# EAGLE design X-mas-star_V2 (EAGLE 9.6.2)
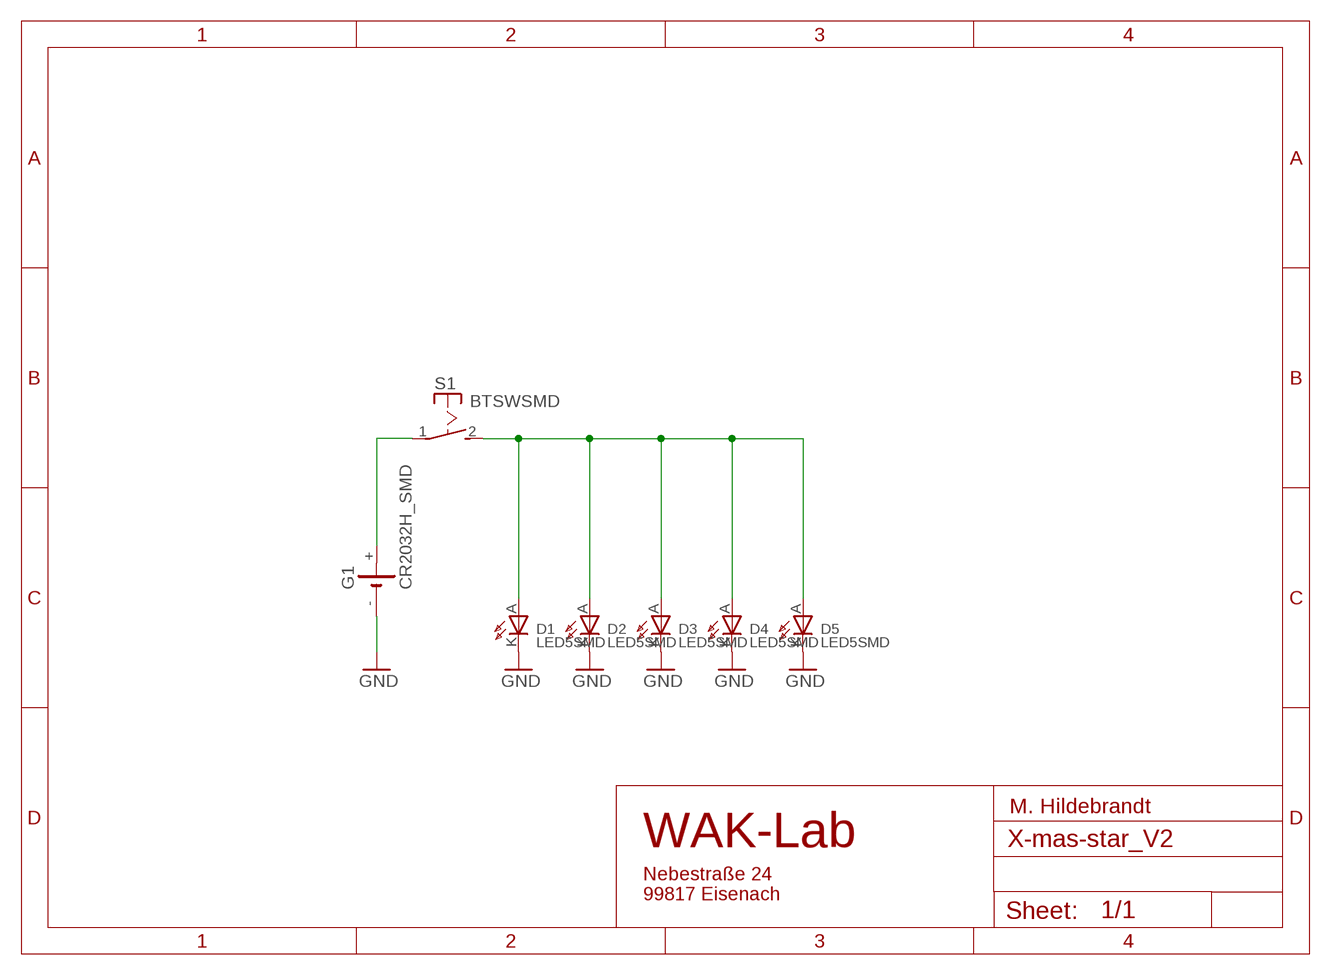
[diagram p0: schematic, sheet 1]

## Parts
D1  LED5SMD  [LED5MM_PADS]
D2  LED5SMD  [LED5MM_PADS]
D3  LED5SMD  [LED5MM_PADS]
D4  LED5SMD  [LED5MM_PADS]
D5  LED5SMD  [LED5MM_PADS]
G1  CR2032H_SMD  [CR2032H_SMD]
S1  BTSWSMD  [BTSW_SMD]

## Nets
GND: D1.K D2.K D3.K D4.K D5.K G1.-
N$12: D1.A D2.A D3.A D4.A D5.A S1.2(S)
N$29: G1.+ S1.1(P)

## Notes on the sheet
- M. Hildebrandt
- WAK-Lab
- Nebestraße 24
  99817 Eisenach

## Library data of the parts
D1-D5 = DIY-Parts:LED5
G1 = battery:CR2032H_SMD
S1 = DIY-Parts:BTSW

## Board
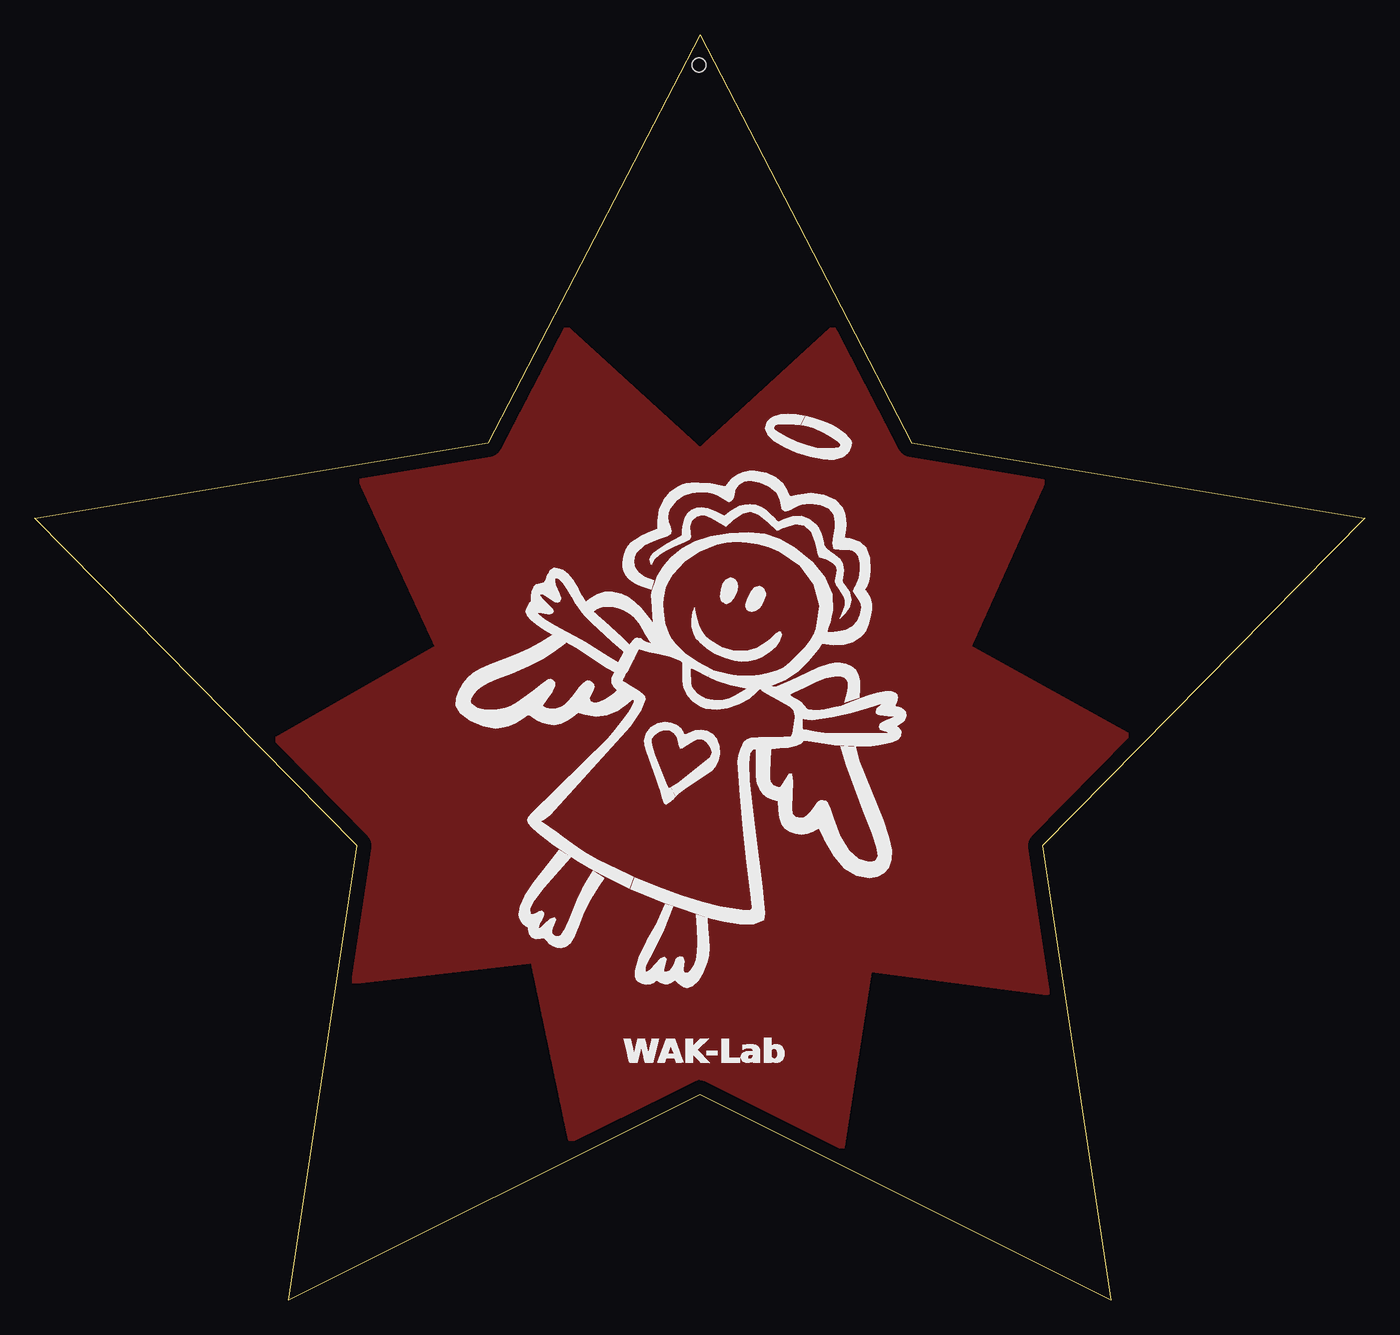
[diagram p1: board, top side]
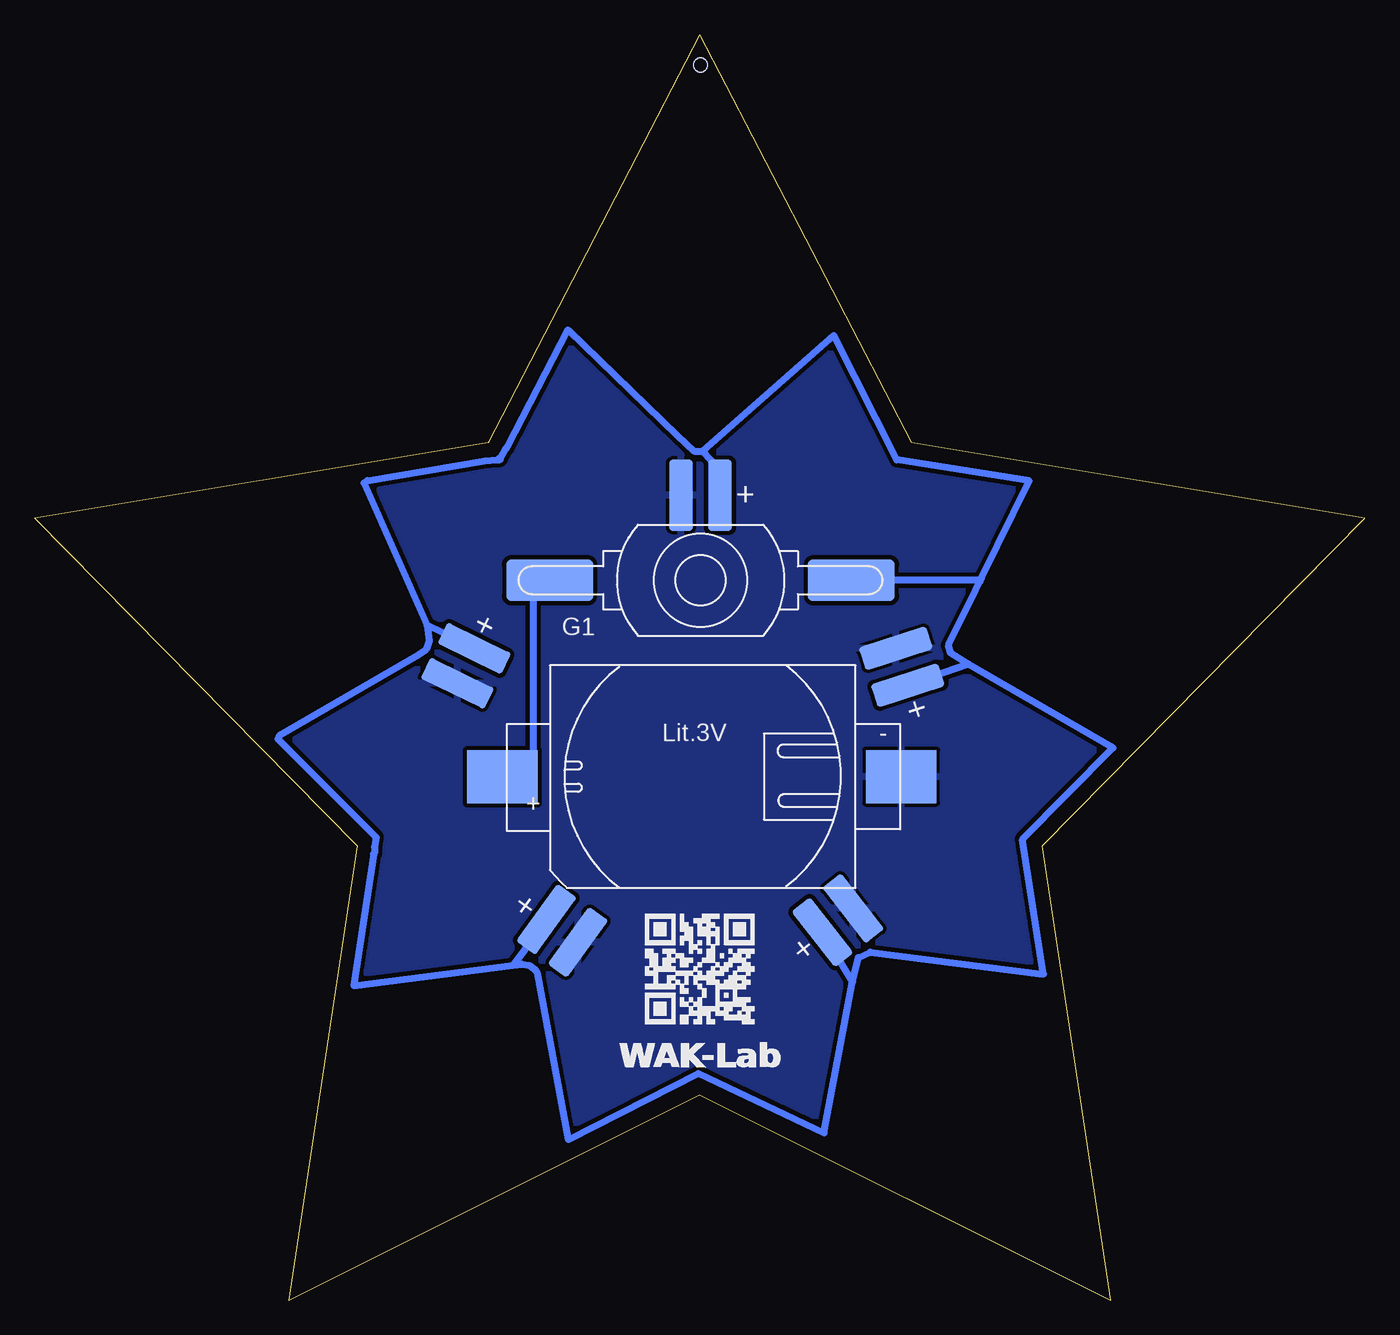
[diagram p2: board, bottom side, seen from below]

Size 95.72 x 91.04 mm. Coordinates in mm from the lower left corner, seen from the top.
Outline: 47.86,91.04 63.11,61.7 95.72,56.26 72.53,32.7 77.44,0 47.86,14.77 18.28,0 23.19,32.7 0,56.26 32.61,61.7 47.86,91.04
Copper layers (1*16): Top 0.035mm / dielectric 1.5mm / Bottom 0.035mm
Design rules "default": minimum track width 6mil, minimum drill 0.35mm, track to track 6mil, track to pad 6mil, pad to pad 6mil, via to via 6mil, smd to smd 6mil, copper to edge 40mil, drill to drill 6mil, minimum pad ring 10mil, minimum via ring 8mil, stop-mask expansion 4mil, vias tented up to drill 0mil, thermal gap 10mil
Holes 1 mm at 47.81,88.86

### Footprints (pad centres in the part's own frame; a part is rotated, then mirrored left to right if it is on the bottom)
LED5MM_PADS = smd 1.7 x 5.08: A 1.397,-2.54; K -1.397,-2.54
CR2032H_SMD = smd 5.08 x 3.81: + -14.415,0; - 14.287,0
BTSW_SMD = smd 6.25 x 3: 1 -10.854,0; 2 10.854,0

### Placement (x,y rotation side)
D1  66.98,46.75 64 bottom
D2  59.26,24.52 144 bottom
D3  47.81,60.45 0 bottom
D4  30.9,46.35 288 bottom
D5  36.36,25.32 218 bottom
G1  47.65,37.67 0 bottom
S1  47.81,51.79 0 bottom

### Tracks (layer width: path | path; a pad name or v marks a point on that pad's centre or on a via)
GND
  pour Bottom (isolate 0.305): 24,59.02 30.03,46.63 17.96,39.65 24.31,32.98 23.04,23.46 36.38,25.04 38.92,12.03 47.81,16.15 57.33,11.39 59.56,24.09 59.87,24.25 72.89,22.66 71.3,32.98 78.61,40.28 66.86,46.95 72.26,59.02 62.73,60.6 57.76,70.21 47.97,60.75 37.97,69.81 33.52,60.92
GND1
  pour Top (isolate 0.305): 23.44,59.1 29.08,46.95 17.41,40.28 24.31,32.98 22.82,22.97 35.9,24.49 38.61,11.59 47.81,16.15 58.05,11 60.03,23.85 60.27,23.85 72.89,22.19 71.3,32.98 78.84,40.44 67.18,46.95 72.57,58.94 62.73,60.76 57.76,70.13 47.88,61.06 38.09,69.99 33.52,60.92
N$12
  Bottom 0.508: D1.A 67.49,48.54 | 67.49,48.54 72.02,58.78 71.78,58.97 63.32,60.38 62.42,60.46 62.34,60.54 62.3,60.45 62.24,60.54 62.22,60.49 62.02,60.88 61.79,61.27 61.71,61.41 57.34,69.81 49.47,62.19 48.28,61.08 47.65,61.08 | 47.65,61.08 46.46,59.81 46.38,58.14 46.38,58.22 D3.A | 67.49,48.54 67.33,47.43 67.57,46.79 68.13,46.4 78.13,40.6 78.21,40.36 71.14,33.3 71.25,32.67 71.26,32.6 71.27,32.16 71.34,32.09 72.76,22.63 61.3,24.09 | 61.3,24.09 59.63,26.31 D2.A | 61.3,24.09 60.67,24.17 60.11,24.09 59.79,23.85 59.56,23.54 57.33,11.55 47.97,16.31 38.92,12.03 36.85,22.9 | 36.85,22.9 D5.A | 36.85,22.9 36.46,24.65 35.58,25.05 23.12,23.46 24.63,33.14 18.12,39.73 28.52,45.76 | 28.52,45.76 D4.A | 28.52,45.76 29.79,46.56 29.95,47.11 28.03,51.03 27.69,51.71 27.65,51.79 | 27.65,51.79 27.58,51.95 24.15,58.94 33.68,60.45 38.2,69.42 47.65,61.08 | 27.65,51.79 S1.2
N$29
  Bottom 0.508: S1.1 58.71,51.78 58.95,51.83 59.87,52.14 59.87,37.9 G1.+ 62.41,37.9